# EAGLE schematic OBDboard (EAGLE 7.6.0)
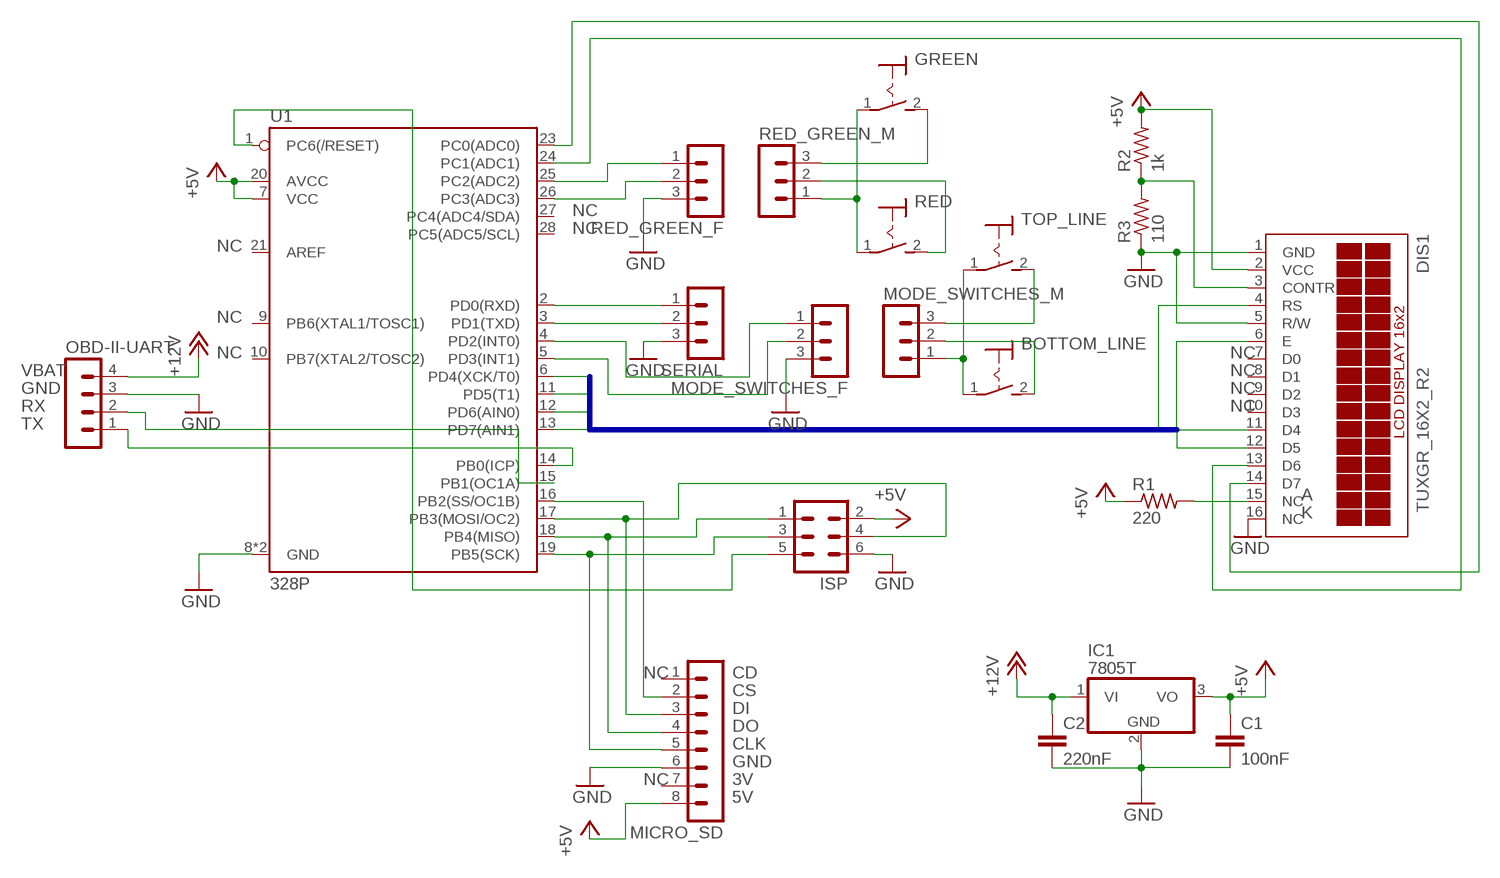
[diagram p0: schematic, sheet 1]

## Parts
BOTTOM_LINE  MS243  [MS243]
C1  100nF  C2.5/2  [C2.5-2]
C2  220nF  C2.5/2  [C2.5-2]
DIS1  TUXGR_16X2_R2  [TUXGR_16X2_R2]
GREEN  MS243  [MS243]
IC1  7805T  [TO220H]
ISP  MA03-2  [MA03-2]
MICRO_SD  MA08-1  [MA08-1]
MODE_SWITCHES_F  MA03-1  [MA03-1]
MODE_SWITCHES_M  MA03-1  [MA03-1]
OBD-II-UART  MA04-1  [MA04-1]
R1  220  R-US_0207/10  [0207/10]
R2  1k  R-US_0207/10  [0207/10]
R3  110  R-US_0207/10  [0207/10]
RED  MS243  [MS243]
RED_GREEN_F  MA03-1  [MA03-1]
RED_GREEN_M  MA03-1  [MA03-1]
SERIAL  MA03-1  [MA03-1]
TOP_LINE  MS243  [MS243]
U1  328P  ATMEGA328P_PDIP  [DIP28]

## Nets
+5V: C1.1 DIS1.2(VCC) IC1.3(VO) ISP.2 MICRO_SD.8 R1.1 R2.2 U1.7(VCC) U1.20(AVCC)
+12V: C2.1 IC1.1(VI) OBD-II-UART.4
A0: DIS1.14(D7) U1.23(PC0(ADC0))
A1: DIS1.13(D6) U1.24(PC1(ADC1))
A2: RED_GREEN_F.1 U1.25(PC2(ADC2))
A3: RED_GREEN_F.2 U1.26(PC3(ADC3))
D2: MODE_SWITCHES_F.1 U1.4(PD2(INT0))
D3: MODE_SWITCHES_F.2 U1.5(PD3(INT1))
D4: DIS1.12(D5) U1.6(PD4(XCK/T0))
D5: DIS1.11(D4) U1.11(PD5(T1))
D6: DIS1.6(E) U1.12(PD6(AIN0))
D7: DIS1.4(RS) U1.13(PD7(AIN1))
D8: OBD-II-UART.1 U1.14(PB0(ICP))
D9: OBD-II-UART.2 U1.15(PB1(OC1A))
D10: MICRO_SD.2 U1.16(PB2(SS/OC1B))
GND: C1.2 C2.2 DIS1.1(GND) DIS1.5(R/W) DIS1.16(NC) IC1.2(GND) ISP.6 MICRO_SD.6 MODE_SWITCHES_F.3 OBD-II-UART.3 R3.1 RED_GREEN_F.3 SERIAL.3 U1.8(GND) U1.22(GND)
MISO: ISP.1 MICRO_SD.4 U1.18(PB4(MISO))
MOSI: ISP.4 MICRO_SD.3 U1.17(PB3(MOSI/OC2))
N$1: MODE_SWITCHES_M.3 TOP_LINE.2(S)
N$2: BOTTOM_LINE.2(S) MODE_SWITCHES_M.2
N$3: BOTTOM_LINE.1(P) MODE_SWITCHES_M.1 TOP_LINE.1(P)
N$4: DIS1.3(CONTR) R2.1 R3.2
N$6: RED.2(S) RED_GREEN_M.2
N$7: GREEN.2(S) RED_GREEN_M.3
N$8: GREEN.1(P) RED.1(P) RED_GREEN_M.1
N$10: DIS1.15(NC) R1.2
RESET: ISP.5 U1.1(PC6(/RESET))
RX: SERIAL.1 U1.2(PD0(RXD))
SCK: ISP.3 MICRO_SD.5 U1.19(PB5(SCK))
TX: SERIAL.2 U1.3(PD1(TXD))
Unconnected: DIS1.7(D0) DIS1.8(D1) DIS1.9(D2) DIS1.10(D3) MICRO_SD.1 MICRO_SD.7 U1.9(PB6(XTAL1/TOSC1)) U1.10(PB7(XTAL2/TOSC2)) U1.21(AREF) U1.27(PC4(ADC4/SDA)) U1.28(PC5(ADC5/SCL))

## Buses
D[4..7]

## Notes on the sheet
- NC
- NC
- NC
- NC
- NC | NC
- VBAT | NC
- GND | NC
- RX | NC
- TX
- A
- K
- NC | CD
- CS
- DI
- DO
- CLK
- GND
- NC | 3V
- 5V

## Library data of the parts
BOTTOM_LINE GREEN RED TOP_LINE = switch:MS243: TOGGLE SWITCH
C1 C2 = capacitor-wima:C: CAPACITOR naming: grid - package width
DIS1 = display-lcd:TUXGR_16X2_R2: Tuxgraphics LCD display 16x2 characters reflective, without background light Source: tuxgr_12x2_r2.pdf; OC_FARNELL: unknown; OC_NEWARK: unknown
IC1 = linear:78*: Positive VOLTAGE REGULATOR Source: http://cache.national.com/ds/LM/LM78L05.pdf http://www.fairchildsemi.com/ds/LM/LM7805.pdf
ISP = con-lstb:MA03-2: PIN HEADER; OC_FARNELL: unknown; OC_NEWARK: unknown
MICRO_SD = con-lstb:MA08-1: PIN HEADER; OC_FARNELL: unknown; OC_NEWARK: unknown
MODE_SWITCHES_F MODE_SWITCHES_M RED_GREEN_F RED_GREEN_M SERIAL = con-lstb:MA03-1: PIN HEADER; OC_FARNELL: unknown; OC_NEWARK: unknown
OBD-II-UART = con-lstb:MA04-1: PIN HEADER; OC_FARNELL: unknown; OC_NEWARK: unknown
R1-R3 = rcl:R-US_: RESISTOR, American symbol
U1 = SparkFun-IC-Microcontroller:ATMEGA328P_PDIP: Atmel 328P Through hole ATMEGA328P uC used in the Arduino 32kb flash, 1k EEPROM, 2k SRAM Datasheet <http://www.sparkfun.com/datasheets/Components/SMD/ATMega328.pdf> SparkFun Products Storefront component: AVR 28 Pin 20MHz 32K 6A/D - ATMega328P <https://www.sparkfun.com/products/9061> (COM-09061) SparkFun Simon Says - Through-Hole Soldering Kit <https://www.sparkfun.com/products/10547> (KIT-10547) SparkFun Learn to Solder - Simon Says <https://www.sparkfun.com/products/13708> (KIT-13708) SparkFun BigTime Watch Kit <https://www.sparkfun.com/products/11734> (KIT-11734) SparkFun ClockIt <https://www.sparkfun.com/products/10930> (KIT-10930) SparkFun Serial Enabled LCD Kit <https://www.sparkfun.com/products/10097> (LCD-10097) SparkFun Simon Tilts - Through Hole Soldering Kit <https://www.sparkfun.com/products/12634> (KIT-12634) SparkFun Frequency Counter Kit <https://www.sparkfun.com/products/10140> (KIT-10140) FabFM Radio Kit <https://www.sparkfun.com/products/11043> (KIT-11043) SparkFun Binary Blaster Kit <https://www.sparkfun.com/products/12037> (KIT-12037) SparkFun Metro-Gnome <https://www.sparkfun.com/products/9236> (KIT-09236) ATmega328 with Arduino Optiboot (Uno) <https://www.sparkfun.com/products/10524> (DEV-10524); PROD_ID: IC-09136